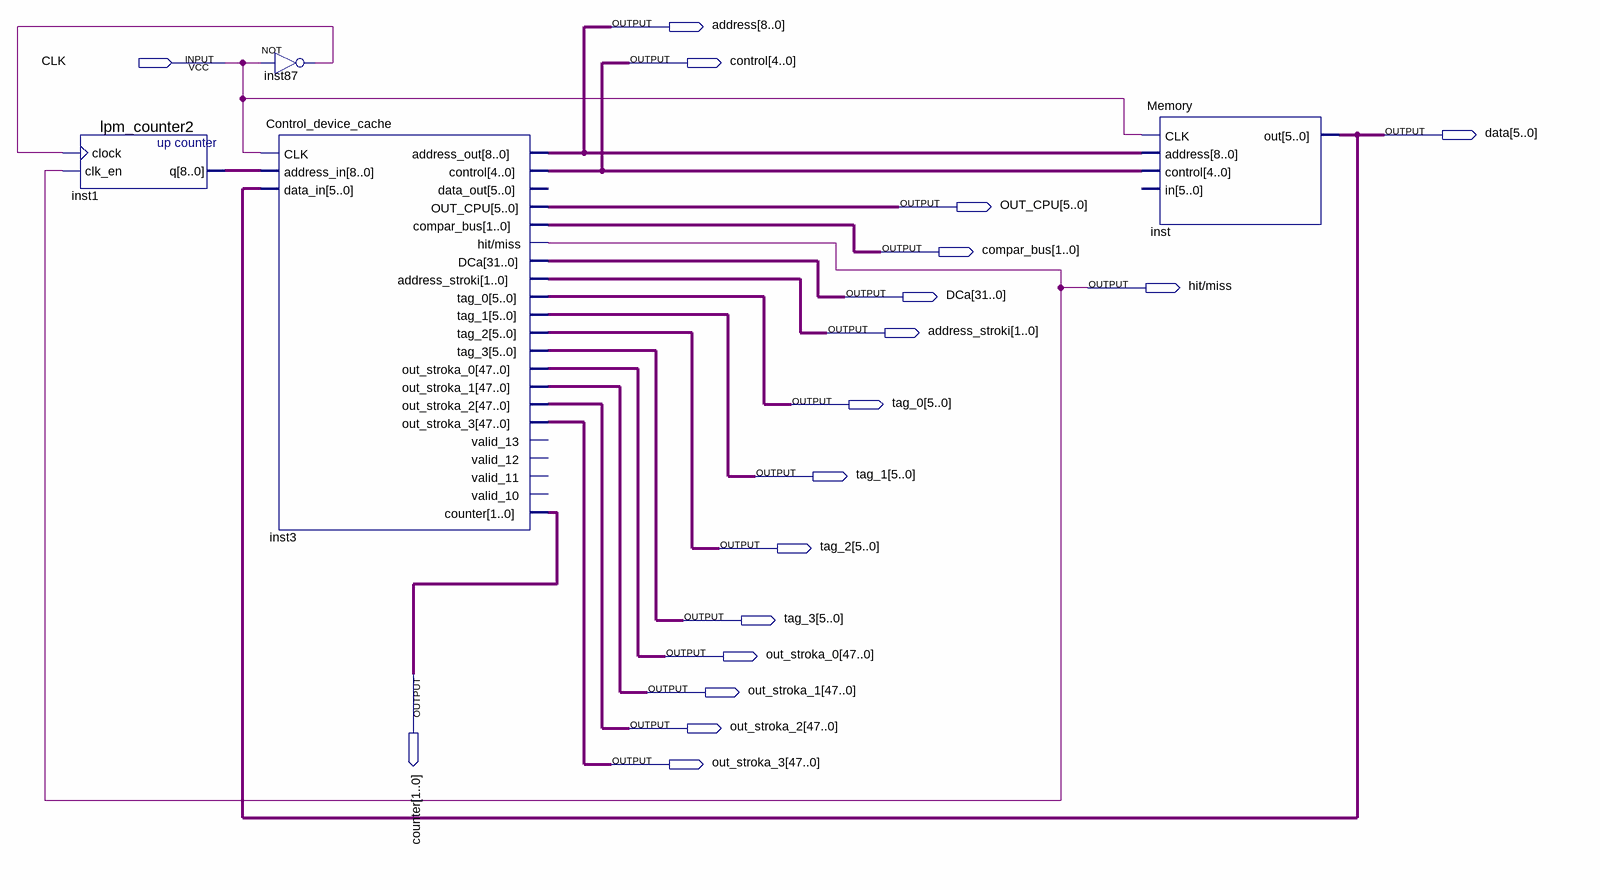
[diagram p0: schematic sheet]
// Quartus schematic Cache.bdf as structural Verilog: 4 symbols, 18 pins
module Cache (
  input  CLK,
  output [8:0] address,
  output [4:0] control,
  output [5:0] data,
  output [5:0] OUT_CPU,
  output [1:0] compar_bus,
  output \hit/miss ,
  output [31:0] DCa,
  output [1:0] address_stroki,
  output [5:0] tag_0,
  output [5:0] tag_1,
  output [5:0] tag_2,
  output [5:0] tag_3,
  output [47:0] out_stroka_0,
  output [1:0] counter,
  output [47:0] out_stroka_1,
  output [47:0] out_stroka_2,
  output [47:0] out_stroka_3
);

  wire inst87_out;
  wire [8:0] inst1_q;

  lpm_counter2 inst1 (.clock(inst87_out), .clk_en(\hit/miss ), .q(inst1_q));
  not inst87 (inst87_out, CLK);
  Control_device_cache inst3 (
    .CLK(CLK), .address_in(inst1_q), .data_in(data), .address_out(address), .control(control),
    .OUT_CPU(OUT_CPU), .compar_bus(compar_bus), .\hit/miss (\hit/miss ), .DCa(DCa),
    .address_stroki(address_stroki), .tag_0(tag_0), .tag_1(tag_1), .tag_2(tag_2), .tag_3(tag_3),
    .out_stroka_0(out_stroka_0), .out_stroka_1(out_stroka_1), .out_stroka_2(out_stroka_2),
    .out_stroka_3(out_stroka_3), .counter(counter));  // open: data_out, valid_13, valid_12, valid_11, valid_10
  Memory inst (.CLK(CLK), .address(address), .control(control), .out(data));  // open: in
endmodule
